# Altium schematic sheet Mppt_Sheet1.SchDoc
size A4
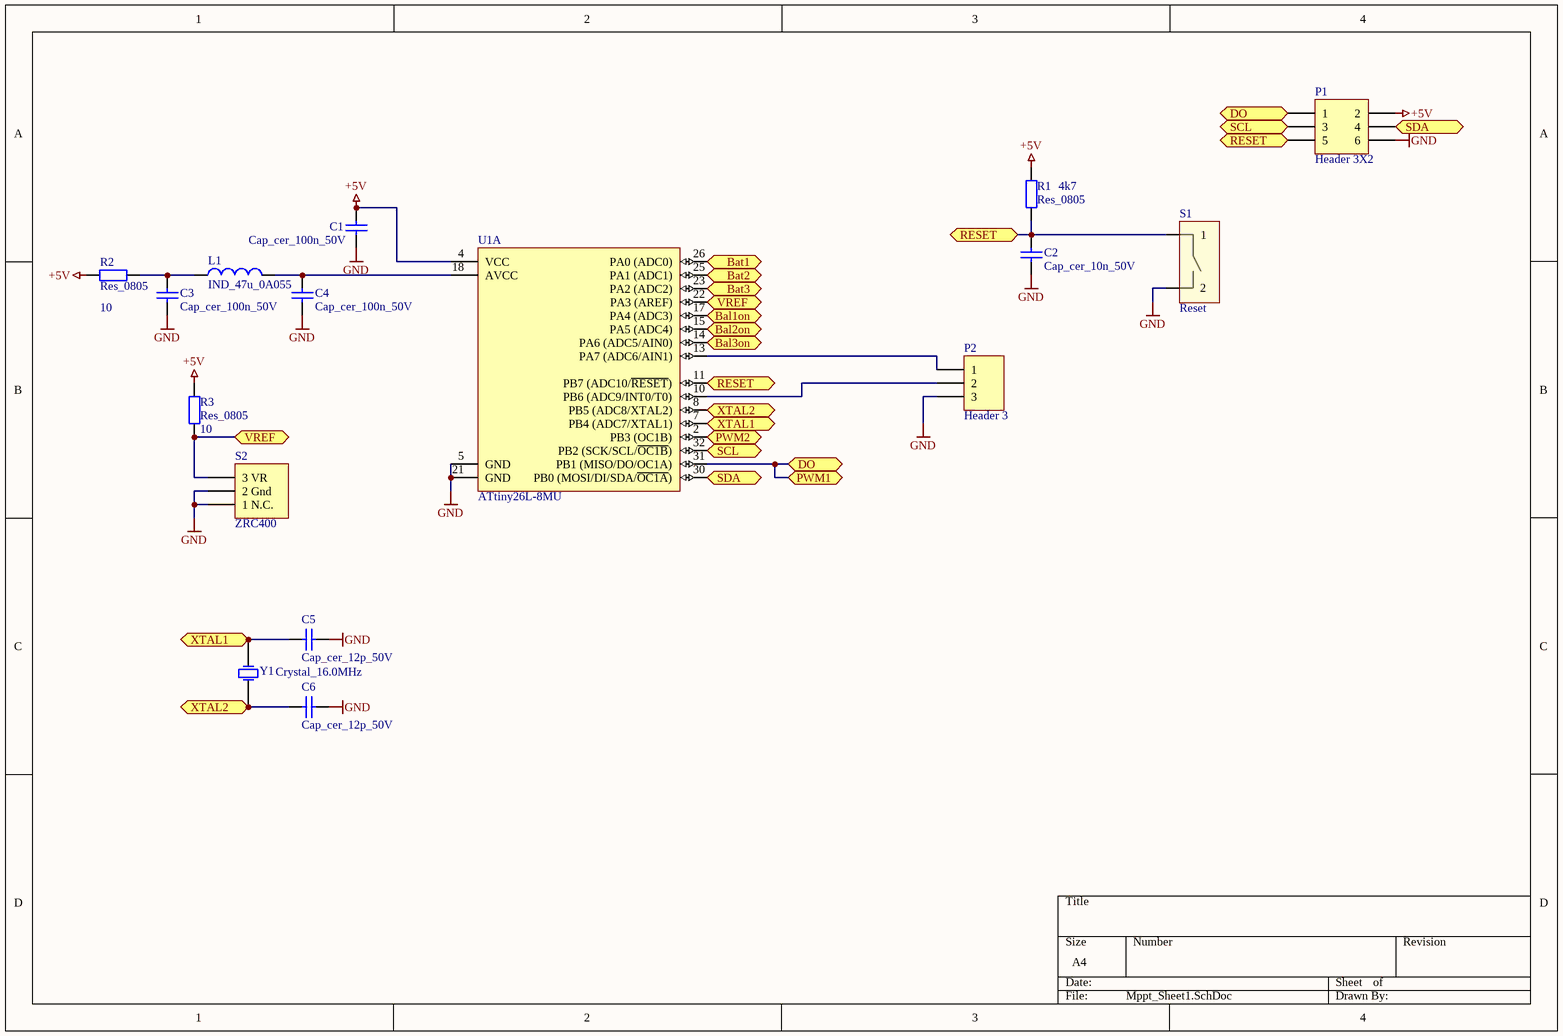
[diagram p0: Mppt_Sheet1.SchDoc]

## Parts
C1  Cap_cer_100n_50V  [_0805]
C2  Cap_cer_10n_50V  [_0805]
C3  Cap_cer_100n_50V  [_0805]
C4  Cap_cer_100n_50V  [_0805]
C5  Cap_cer_12p_50V  [_0805]
C6  Cap_cer_12p_50V  [_0805]
L1  IND_47u_0A055  [COIL_0805]
P1  Header 3X2  [HDR2X3]
P2  Header 3  [HDR1X3]
R1  Res_0805  value 4k7  [_0805]
R2  Res_0805  value 10  [_0805]
R3  Res_0805  value 10  [_0805]
S1  Reset  [SWITCH_SMD]
S2  ZRC400  [SOT23_N]
U1  ATtiny26L-8MU  [32M1-A_N]  (part A of 2)
Y1  Crystal_16.0MHz  [XTAL_SMD]

## Ports
Bal1on, Bal2on, Bal3on, Bat1, Bat2, Bat3, DO, PWM1, PWM2, RESET, SCL, SDA, VREF, XTAL1, XTAL2

## Nets
+5V: C1.2 P1.2 R1.1 R2.1 R3.2 U1.4(VCC)
GND: C1.1 C2.2 C3.1 C4.1 C5.2 C6.2 P1.6 P2.3 S1.2 S2.1(1_N.C.) S2.2(2_Gnd) U1.5(GND) U1.21(GND)
Bal1on: U1.17(PA4_(ADC3)) ; port Bal1on
Bal2on: U1.15(PA5_(ADC4)) ; port Bal2on
Bal3on: U1.14(PA6_(ADC5/AIN0)) ; port Bal3on
Bat1: U1.26(PA0_(ADC0)) ; port Bat1
Bat2: U1.25(PA1_(ADC1)) ; port Bat2
Bat3: U1.23(PA2_(ADC2)) ; port Bat3
DO: P1.1 U1.31(PB1_(MISO/DO/OC1A)) ; port DO, port PWM1
PWM2: U1.2(PB3_(OC1B)) ; port PWM2
RESET: C2.1 P1.5 R1.2 S1.1 U1.11(PB7_(ADC10/~{RESET})) ; port RESET
SCL: P1.3 U1.32(PB2_(SCK/SCL/~{OC1B})) ; port SCL
SDA: P1.4 U1.30(PB0_(MOSI/DI/SDA/~{OC1A})) ; port SDA
VREF: R3.1 S2.3(3_VR) U1.22(PA3_(AREF)) ; port VREF
XTAL1: C5.1 U1.7(PB4_(ADC7/XTAL1)) Y1.2(OSC2) ; port XTAL1
XTAL2: C6.1 U1.8(PB5_(ADC8/XTAL2)) Y1.1(OSC1) ; port XTAL2
NetC3_2: C3.2 L1.1 R2.2
NetC4_2: C4.2 L1.2 U1.18(AVCC)
NetP2_1: P2.1 U1.13(PA7_(ADC6/AIN1))
NetP2_2: P2.2 U1.10(PB6_(ADC9/INT0/T0))

## Library data of the parts
C1 C3 C4 = Cap_124: QR: 0; Capacity: 100n; Voltage: 50V; UID: Cap_124; Name: Cap_cer_100n_50V; ComponentLink1URL: #NAME?; mounting: SMD
C2 = Cap_120: QR: 0; Capacity: 10n; Voltage: 50V; UID: Cap_120; Name: Cap_cer_10n_50V; ComponentLink1URL: #NAME?; mounting: SMD
C5 C6 = Cap_109: RS_number: 723-6206; QR: 0; Capacity: 12p; Voltage: 50V; UID: Cap_109; Name: Cap_cer_12p_50V; Name_Hyperlink: Keramikkondensator SMT 12 pF 50 VDC; ComponentLink1URL: #NAME?; mounting: SMD
L1 = Ind_41: Inductor; RS_number: 469-2883; QR: 0; Inductivity: 47 uH; Current: 0A055; UID: Ind_41; Name: IND_47u_0A055; Name_Hyperlink: http://at.rs-online.com/web/p/drahtgewickelte-smd-induktivitaten/4692883/?searchTerm=4692883&relevancy-data=636F3D3126696E3D4931384E525353746F636B4E756D6265724D504E266C753D656E266D6D3D6D61746368616C6C26706D3D5E5C647B367D247C5E5C647B377D247C5E5C647B31307D2; ComponentLink1URL: #NAME?; mounting: SMD
P1 = Con_41: QR: 0; UID: Con_41; Name: Header 3X2; mounting: THT; Pins: 2X3
P2 = Con_32: QR: 0; UID: Con_32; Name: Header 3; mounting: THT; Pins: 1X3
R1-R3 = Res_6: UID: Res_6; Name: Res_0805; ComponentLink1URL: #NAME?; mounting: SMD
S1 = Misc_11: QR: 0; UID: Misc_11; Name: Reset; ComponentLink1URL: #NAME?; mounting: SMD
S2 = Misc_1: 4,096V Voltage Regulator; QR: 0; UID: ZRC400; Name: ZRC400; ComponentLink1URL: http://at.rs-online.com/web/p/referenzspannungs-ics/7385115/; mounting: THT
U1 = ATtiny26L-8MU: 8-bit AVR Microcontroller, 2.7-5.5V, 8MHz, 2KB Flash, 128 Bytes EEPROM, 128 Bytes SRAM, 32-pin MLF, Industrial Grade (-40°C to 85°C), Pb-Free; DatasheetVersion: revK, Aug-2010; PackageVersion: revE, May-2006; PackageReference: 32M1-A; PackageDescription: 32-Pin Micro Lead Frame Package (MLF),  5 x 5 x 1.0 mm Body, Pitch 0.50 mm, 3.10mm Exposed Pad; Code_JEDEC: MO-220-VHHD-2; ComponentLink1Description: Manufacturer URL; ComponentLink1URL: http://www.atmel.com/; ComponentLink2Description: ATtiny26(L) Datasheet; ComponentLink2URL: http://www.atmel.com/dyn/resources/prod_documents/doc1477.pdf; ComponentLink3Description: ATtiny26(L) Summary; ComponentLink3URL: http://www.atmel.com/dyn/resources/prod_documents/1477S.pdf
Y1 = Crystal_19: RS_number: 703-1957; QR: 1; UID: Crystal_19; Name: Crystal_16.0MHz; Frequency: 16.0 MHz; Name_Hyperlink: Crystal, ABM7, 16.000MHz, SMD; ComponentLink1URL: #NAME?; mounting: SMD